# EAGLE design icd_a1 (EAGLE 5.11)
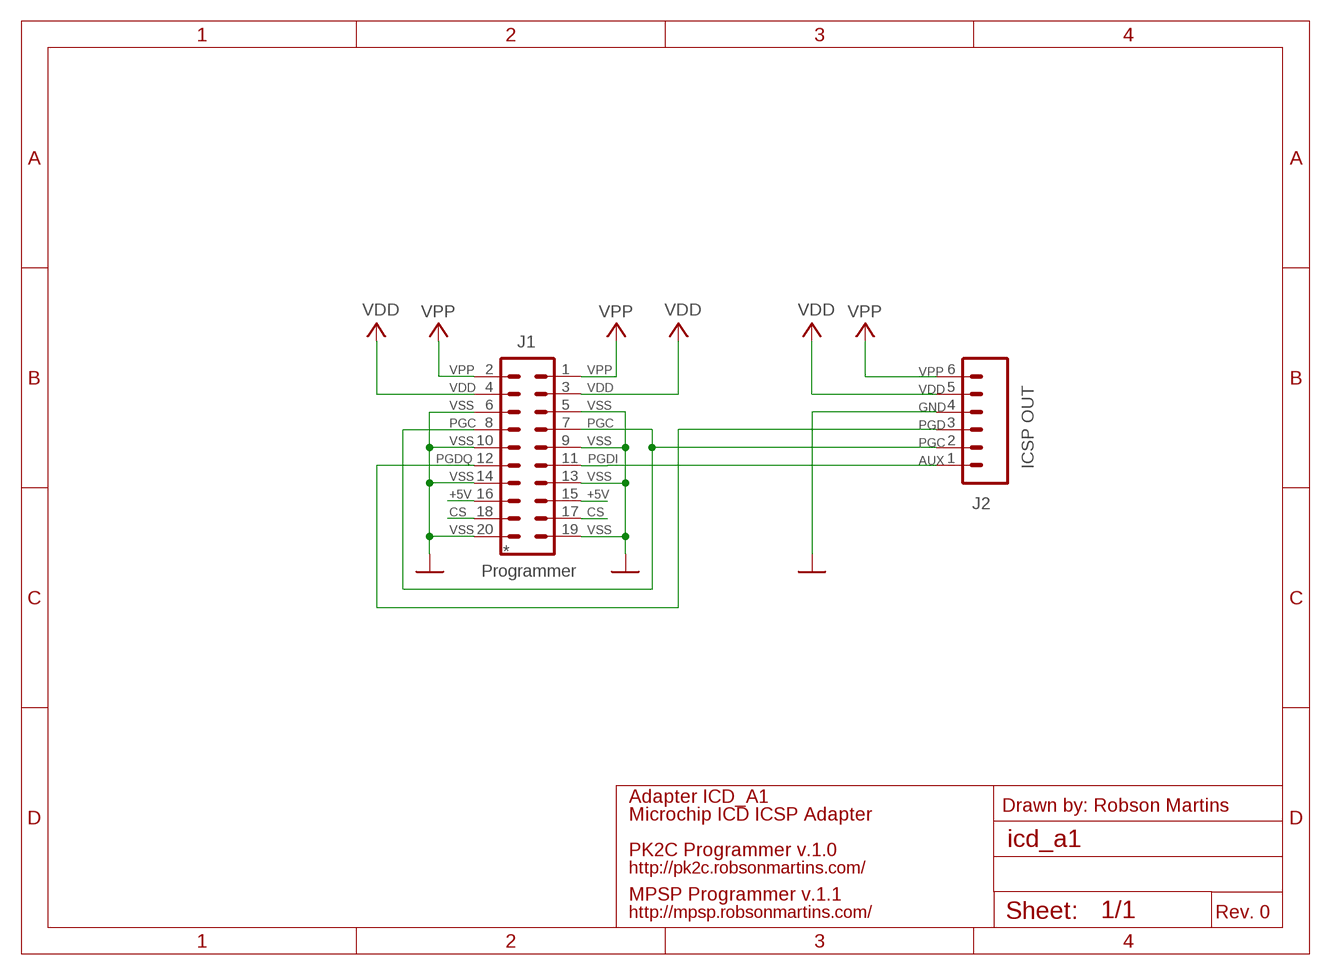
[diagram p0: schematic, sheet 1]

## Parts
J1  Programmer  MA10-2  [MA10-2]
J2  ICSP OUT  RJ11-6PTH  [RJ11-6]

## Nets
+5V: J1.15 J1.16
AUX: J1.11 J2.1
CS: J1.17 J1.18
GND: J1.5 J1.6 J1.9 J1.10 J1.13 J1.14 J1.19 J1.20 J2.4
PGC: J1.7 J1.8 J2.2
PGD: J1.12 J2.3
VDD: J1.3 J1.4 J2.5
VPP: J1.1 J1.2 J2.6

## Notes on the sheet
- VPP | VPP
- VDD | VDD
- VSS | VSS
- PGC | PGC
- VSS | VSS
- PGDQ | PGDI
- VSS | VSS
- +5V | +5V
- CS | CS
- VSS | VSS
- *
- Adapter ICD_A1
- Drawn by: Robson Martins
- Microchip ICD ICSP Adapter
- PK2C Programmer v.1.0
- http://pk2c.robsonmartins.com/
- MPSP Programmer v.1.1
- http://mpsp.robsonmartins.com/ | Rev. 0

## Library data of the parts
J1 = con-lstb:MA10-2: PIN HEADER; OC_FARNELL: unknown; OC_NEWARK: unknown
J2 = SparkFun:RJ11-6: RJ11 Jack Simple 6 pin RJ11 jack. Commonly found on CAT3 devices and Microchip programmers. SKU: PRT-00132

## Board
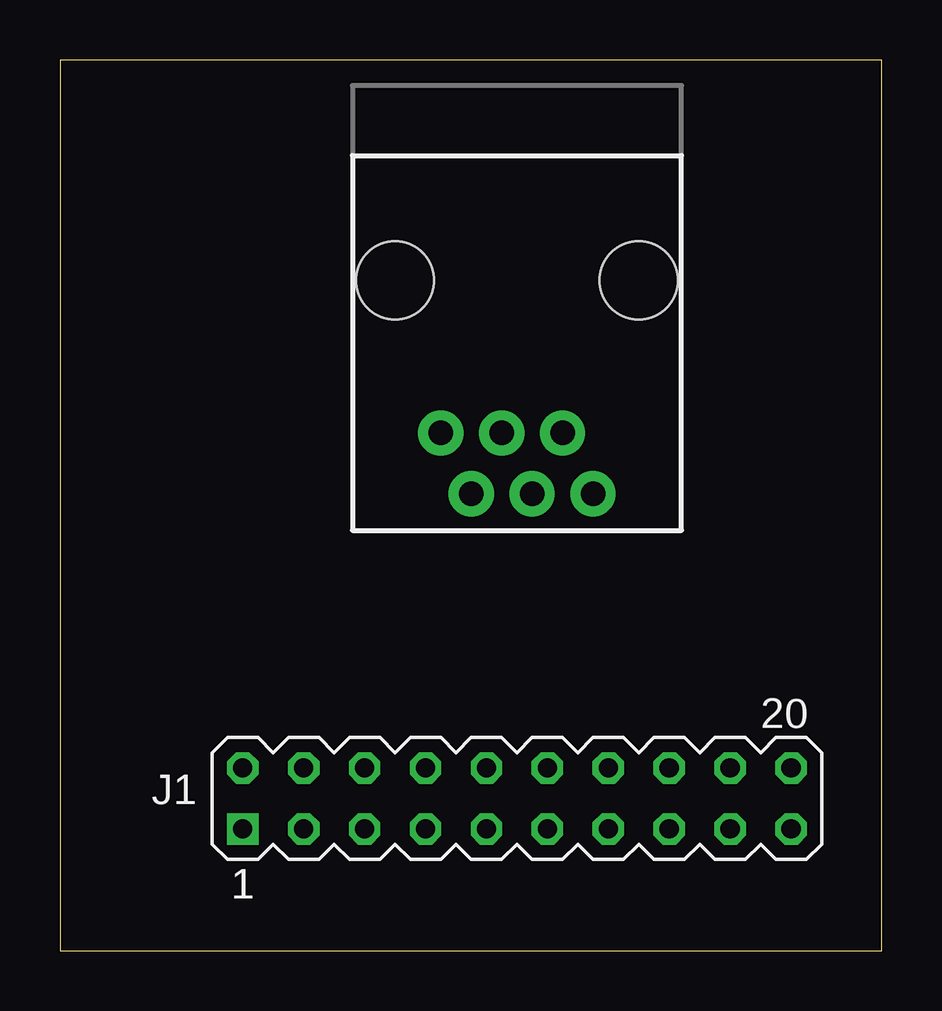
[diagram p1: board, top side]
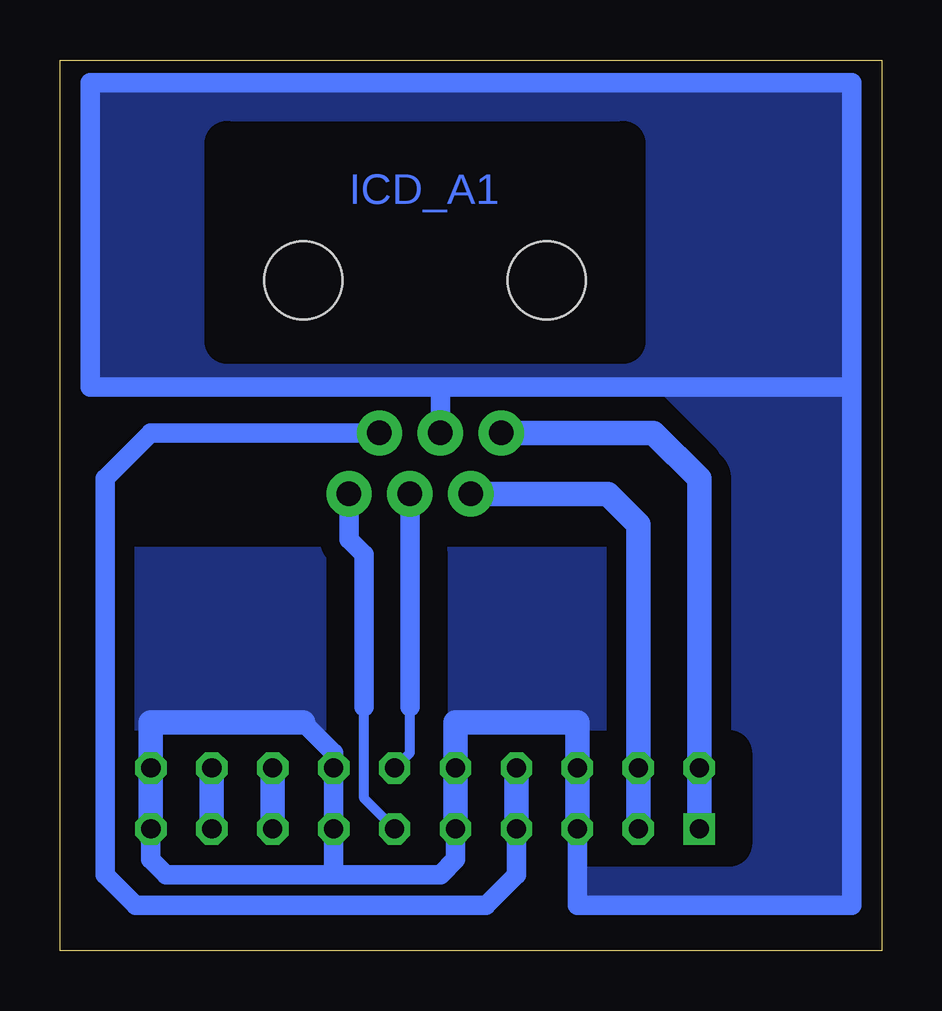
[diagram p2: board, bottom side, seen from below]

Size 34.27 x 37.13 mm. Coordinates in mm from the lower left corner, seen from the top.
Outline: 0,0 34.27,0 34.27,37.13 0,37.13 0,0
Copper layers (1*16): Top 0.035mm / dielectric 1.5mm / Bottom 0.035mm
Design rules "default": minimum track width 10mil, minimum drill 24mil, track to track 8mil, track to pad 8mil, pad to pad 8mil, via to via 8mil, smd to smd 8mil, copper to edge 40mil, drill to drill 8mil, minimum pad ring 10mil, minimum via ring 8mil, stop-mask expansion 4mil, vias tented up to drill 0mil, thermal gap 10mil
bRestrict: area 6.3,1.9 to 31.8,16.5; area 7.6,17.8 to 33,22.9; area 10.8,25.4 to 27.3,33.7

### Footprints (pad centres in the part's own frame; a part is rotated, then mirrored left to right if it is on the bottom)
MA10-2 = drill 0.8 pad 1.27 square: 1 -11.43,-1.27 | drill 0.8 pad 1.27 octagon: 2 -11.43,1.27; 3 -8.89,-1.27; 4 -8.89,1.27; 5 -6.35,-1.27; 6 -6.35,1.27; 7 -3.81,-1.27; 8 -3.81,1.27; 9 -1.27,-1.27; 10 -1.27,1.27; 11 1.27,-1.27; 12 1.27,1.27; 13 3.81,-1.27; 14 3.81,1.27; 15 6.35,-1.27; 16 6.35,1.27; 17 8.89,-1.27; 18 8.89,1.27; 19 11.43,-1.27; 20 11.43,1.27
RJ11-6 = drill 1.016 pad 1.88 round: 1 1.905,8.89; 2 3.175,6.35; 3 4.445,8.89; 4 5.715,6.35; 5 6.985,8.89; 6 8.255,6.35 | hole 3.251: 0,0; 10.16,0

### Placement (x,y rotation side)
J1  19.05,6.35 0 top
J2  24.13,27.94 180 top

### Tracks (layer width: path | path; a pad name or v marks a point on that pad's centre or on a via)
+5V
  Bottom 1.016: J1.15 J1.16
AUX
  Bottom 0.406: J1.11 21.59,6.35 21.59,10.16
  Bottom 0.813: 21.59,10.16 21.59,13.97 21.59,16.51 22.23,17.14 J2.1
CS
  Bottom 1.016: J1.17 J1.18
GND
  Bottom 0.813: 1.27,1.91 1.27,2.54 | 1.27,1.91 1.27,2.54 | 1.27,2.54 1.27,23.5 | 1.27,23.5 1.27,33.66 1.27,36.2 5.71,36.2 21.59,36.2 31.75,36.2 33.02,36.2 33.02,23.5 32.38,23.5 18.41,23.5 | 18.41,23.5 J2.4 | 1.27,23.5 18.41,23.5 | J1.5 12.7,1.91 1.27,1.91 | J1.10 17.78,3.81 18.41,3.17 22.86,3.17 | 22.86,3.17 29.84,3.17 30.48,3.81 J1.19 | 22.86,3.17 J1.13 J1.14 22.86,8.26 24.13,9.53
  Bottom 1.016: J1.19 J1.20 30.48,9.53 24.13,9.53 | J1.10 17.78,6.35 | J1.10 J1.9 | J1.5 J1.6 12.7,8.89 12.7,9.53 13.34,9.53 17.14,9.53 17.78,9.53 17.78,8.89 J1.10
  pour Bottom (isolate 0.813): 0.64,1.91 0.64,36.83 33.66,36.83 33.66,1.91
PGC
  Bottom 0.813: J1.7 15.24,3.17 16.51,1.91 31.11,1.91 32.38,3.17 32.38,19.68 30.48,21.59 J2.2
  Bottom 1.016: J1.7 J1.8
PGD
  Bottom 0.406: 19.68,10.16 19.68,8.26 J1.12
  Bottom 0.813: 19.68,10.16 J2.3
VDD
  Bottom 1.016: J1.3 J1.4 10.16,17.78 11.43,19.05 J2.5
VPP
  Bottom 1.016: J1.1 J1.2 7.62,19.68 9.53,21.59 J2.6

### Text on the board
Bottom: ICD_A1
tDocu: ICD Connector | ICD_A1 Adapter | VSS | VPP | VDD | VSS | PGC | VSS | PGD | VSS | +5V | CS